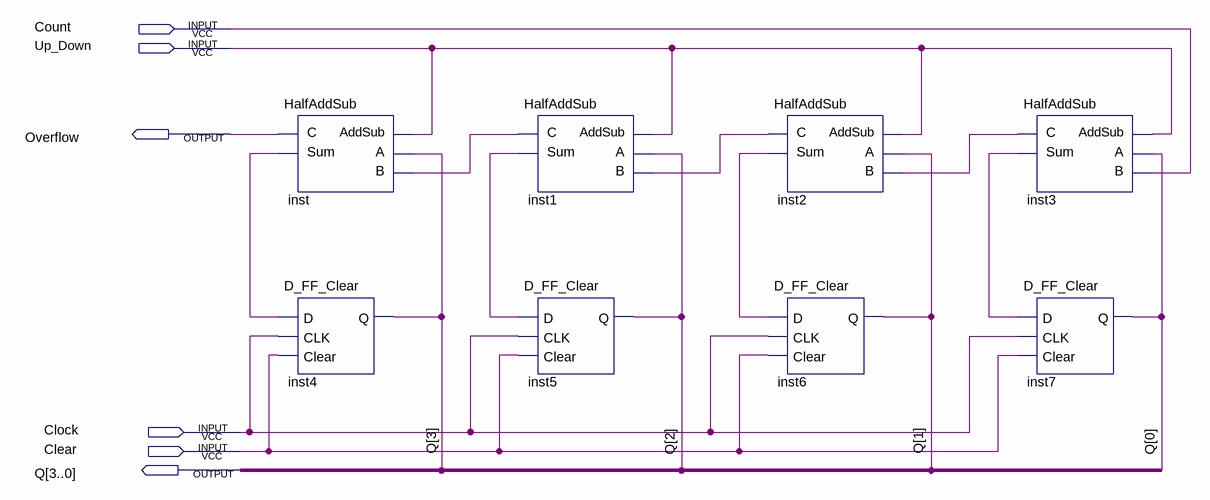
[diagram p0: schematic sheet]
// Quartus schematic BCD_Counter.bdf as structural Verilog: 8 symbols, 6 pins
module BCD_Counter (
  input  Count,
  input  Up_Down,
  input  Clock,
  input  Clear,
  output Overflow,
  output [3:0] Q
);

  wire inst1_c, inst1_sum, inst2_c, inst2_sum, inst3_c, inst3_sum, inst_sum;

  HalfAddSub inst (.AddSub(Up_Down), .A(Q[3]), .B(inst1_c), .C(Overflow), .Sum(inst_sum));
  D_FF_Clear inst4 (.D(inst_sum), .CLK(Clock), .Clear(Clear), .Q(Q[3]));
  HalfAddSub inst1 (.AddSub(Up_Down), .A(Q[2]), .B(inst2_c), .C(inst1_c), .Sum(inst1_sum));
  D_FF_Clear inst5 (.D(inst1_sum), .CLK(Clock), .Clear(Clear), .Q(Q[2]));
  HalfAddSub inst2 (.AddSub(Up_Down), .A(Q[1]), .B(inst3_c), .C(inst2_c), .Sum(inst2_sum));
  D_FF_Clear inst6 (.D(inst2_sum), .CLK(Clock), .Clear(Clear), .Q(Q[1]));
  HalfAddSub inst3 (.AddSub(Up_Down), .A(Q[0]), .B(Count), .C(inst3_c), .Sum(inst3_sum));
  D_FF_Clear inst7 (.D(inst3_sum), .CLK(Clock), .Clear(Clear), .Q(Q[0]));
endmodule
